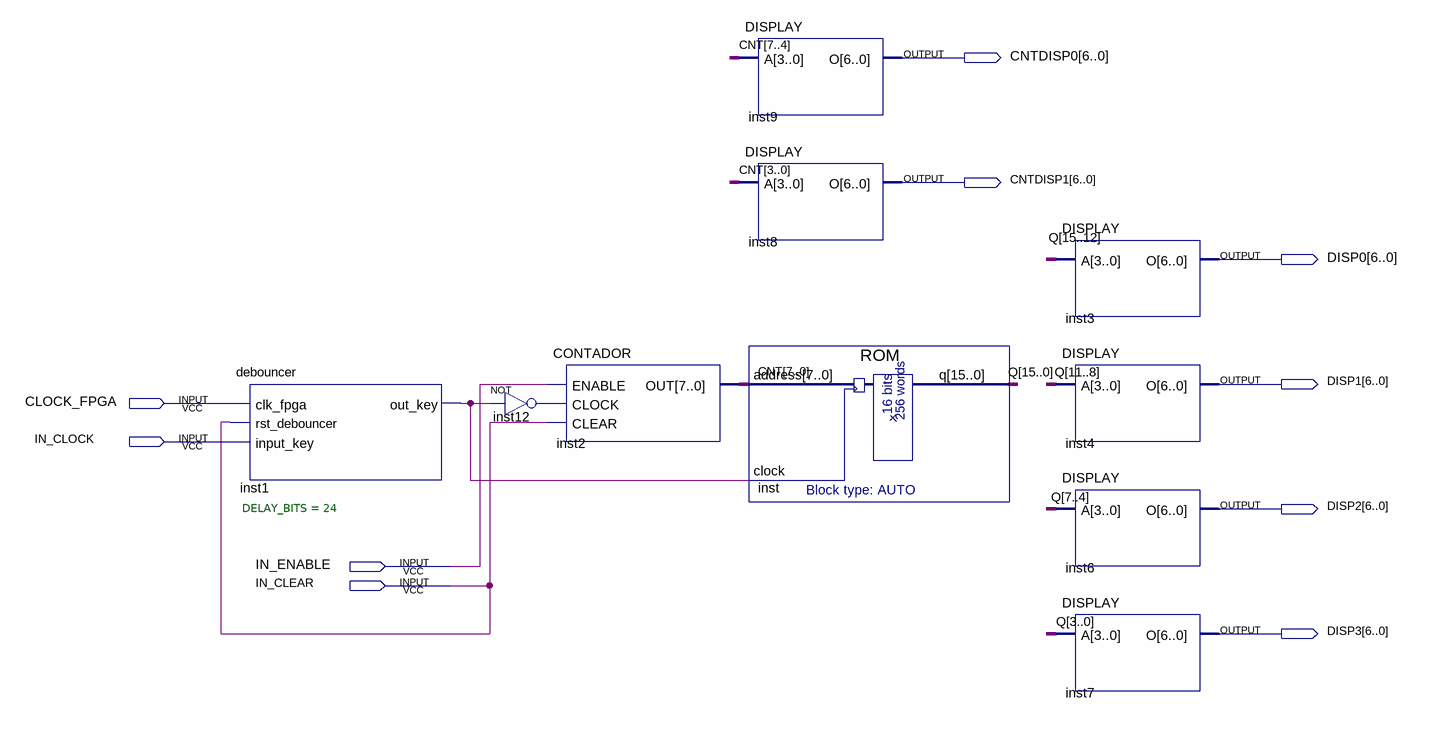
[diagram p0: schematic sheet]
// Quartus schematic TESTE_ROM.bdf as structural Verilog: 10 symbols, 10 pins
module TESTE_ROM (
  input  CLOCK_FPGA,
  input  IN_CLOCK,
  input  IN_ENABLE,
  input  IN_CLEAR,
  output [6:0] CNTDISP0,
  output [6:0] CNTDISP1,
  output [6:0] DISP0,
  output [6:0] DISP1,
  output [6:0] DISP2,
  output [6:0] DISP3
);

  wire inst1_out_key, inst12_out;
  wire [7:0] CNT;
  wire [15:0] Q;

  debouncer #(.DELAY_BITS(24)) inst1 (
    .clk_fpga(CLOCK_FPGA), .rst_debouncer(IN_CLEAR), .input_key(IN_CLOCK), .out_key(inst1_out_key));
  CONTADOR inst2 (.ENABLE(IN_ENABLE), .CLOCK(inst12_out), .CLEAR(IN_CLEAR), .OUT(CNT));
  not inst12 (inst12_out, inst1_out_key);
  DISPLAY inst9 (.A(CNT[7:4]), .O(CNTDISP0));
  DISPLAY inst8 (.A(CNT[3:0]), .O(CNTDISP1));
  ROM inst (.address(CNT), .clock(inst1_out_key), .q(Q));
  DISPLAY inst3 (.A(Q[15:12]), .O(DISP0));
  DISPLAY inst4 (.A(Q[11:8]), .O(DISP1));
  DISPLAY inst6 (.A(Q[7:4]), .O(DISP2));
  DISPLAY inst7 (.A(Q[3:0]), .O(DISP3));
endmodule
